# Altium schematic sheet top.SchDoc
size A4
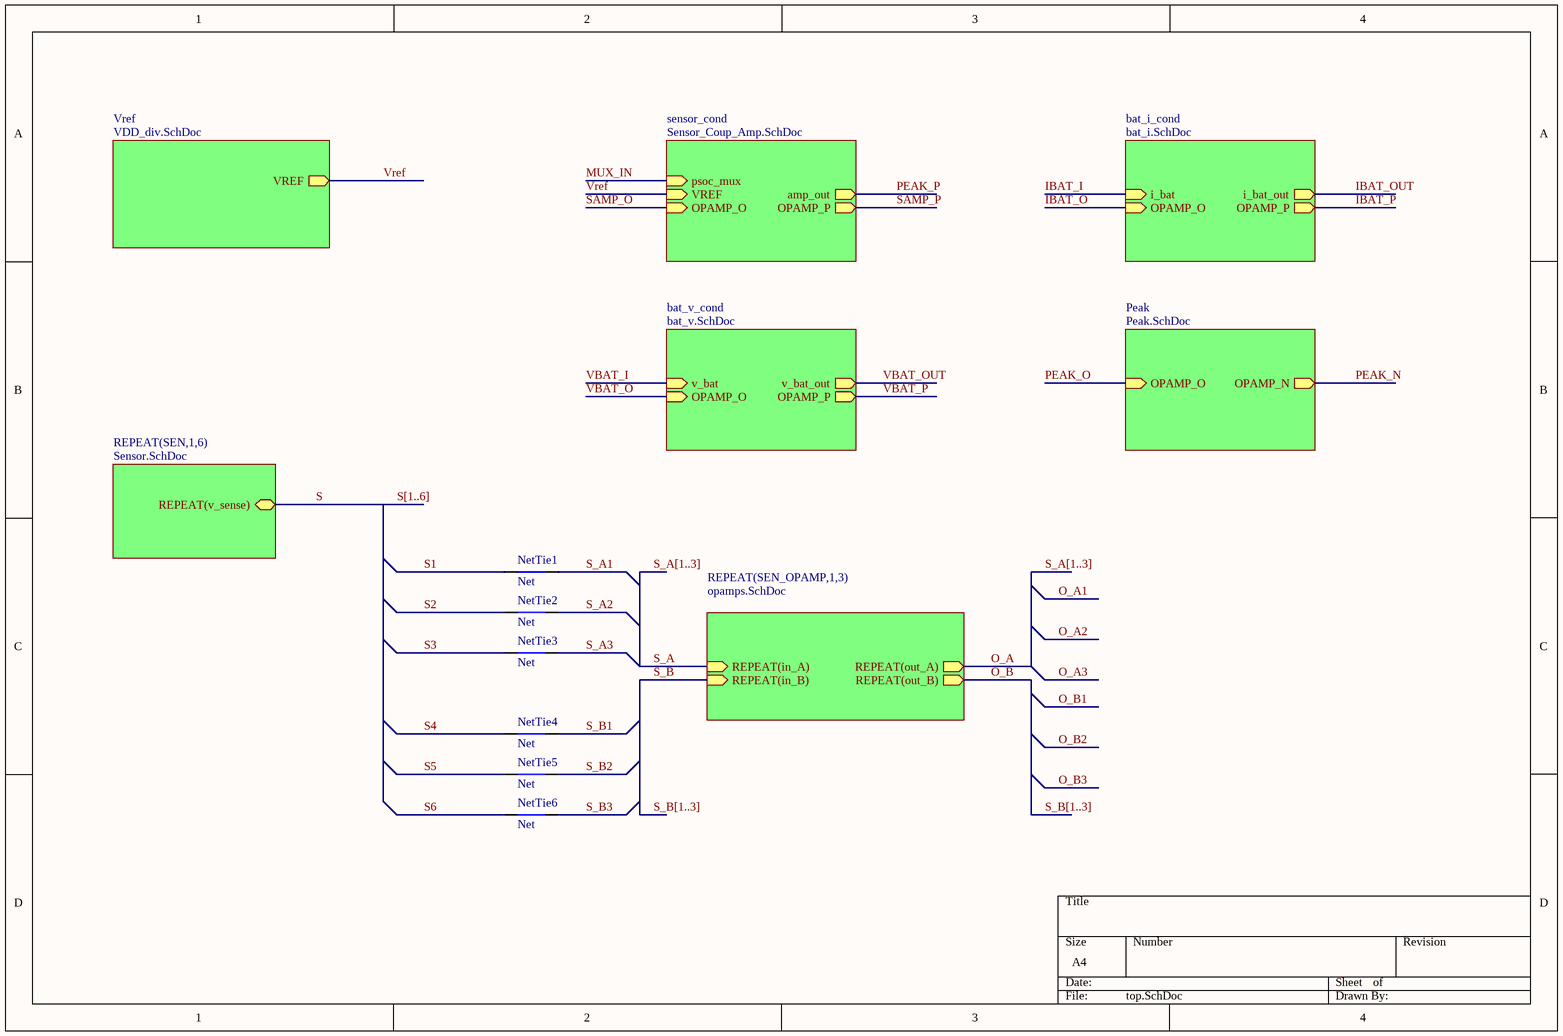
[diagram p0: top.SchDoc]

## Parts
NetTie1  Net  (net tie, no BOM)
NetTie2  Net  (net tie, no BOM)
NetTie3  Net  (net tie, no BOM)
NetTie4  Net  (net tie, no BOM)
NetTie5  Net  (net tie, no BOM)
NetTie6  Net  (net tie, no BOM)

## Sub-sheets
bat_i_cond = bat_i.SchDoc: i_bat (in), i_bat_out (out), OPAMP_P (out), OPAMP_O (in)
bat_v_cond = bat_v.SchDoc: v_bat (in), v_bat_out (out), OPAMP_P (out), OPAMP_O (in)
Peak = Peak.SchDoc: OPAMP_O (in), OPAMP_N (out)
REPEAT(SEN,1,6) = Sensor.SchDoc: REPEAT(v_sense)
REPEAT(SEN_OPAMP,1,3) = opamps.SchDoc: REPEAT(in_A) (in), REPEAT(out_A) (out), REPEAT(out_B) (out), REPEAT(in_B) (in)
sensor_cond = Sensor_Coup_Amp.SchDoc: psoc_mux (in), VREF (in), amp_out (out), OPAMP_P (out), OPAMP_O (in)
Vref = VDD_div.SchDoc: VREF (out)

## Nets
IBAT_I: sheet bat_i_cond/i_bat
IBAT_O: sheet bat_i_cond/OPAMP_O
IBAT_OUT: sheet bat_i_cond/i_bat_out
IBAT_P: sheet bat_i_cond/OPAMP_P
MUX_IN: sheet sensor_cond/psoc_mux
O_A: sheet REPEAT(SEN_OPAMP,1,3)/REPEAT(out_A)
O_B: sheet REPEAT(SEN_OPAMP,1,3)/REPEAT(out_B)
PEAK_N: sheet Peak/OPAMP_N
PEAK_O: sheet Peak/OPAMP_O
PEAK_P: sheet sensor_cond/amp_out
S: sheet REPEAT(SEN,1,6)/REPEAT(v_sense)
S1: NetTie1.1
S2: NetTie2.1
S3: NetTie3.1
S4: NetTie4.1
S5: NetTie5.1
S6: NetTie6.1
S_A: sheet REPEAT(SEN_OPAMP,1,3)/REPEAT(in_A)
S_A1: NetTie1.2
S_A2: NetTie2.2
S_A3: NetTie3.2
S_B: sheet REPEAT(SEN_OPAMP,1,3)/REPEAT(in_B)
S_B1: NetTie4.2
S_B2: NetTie5.2
S_B3: NetTie6.2
SAMP_O: sheet sensor_cond/OPAMP_O
SAMP_P: sheet sensor_cond/OPAMP_P
VBAT_I: sheet bat_v_cond/v_bat
VBAT_O: sheet bat_v_cond/OPAMP_O
VBAT_OUT: sheet bat_v_cond/v_bat_out
VBAT_P: sheet bat_v_cond/OPAMP_P
Vref: sheet sensor_cond/VREF, sheet Vref/VREF

## Buses and harness runs
bus S[1..6]
bus S_A[1..3]
bus S_B[1..3]